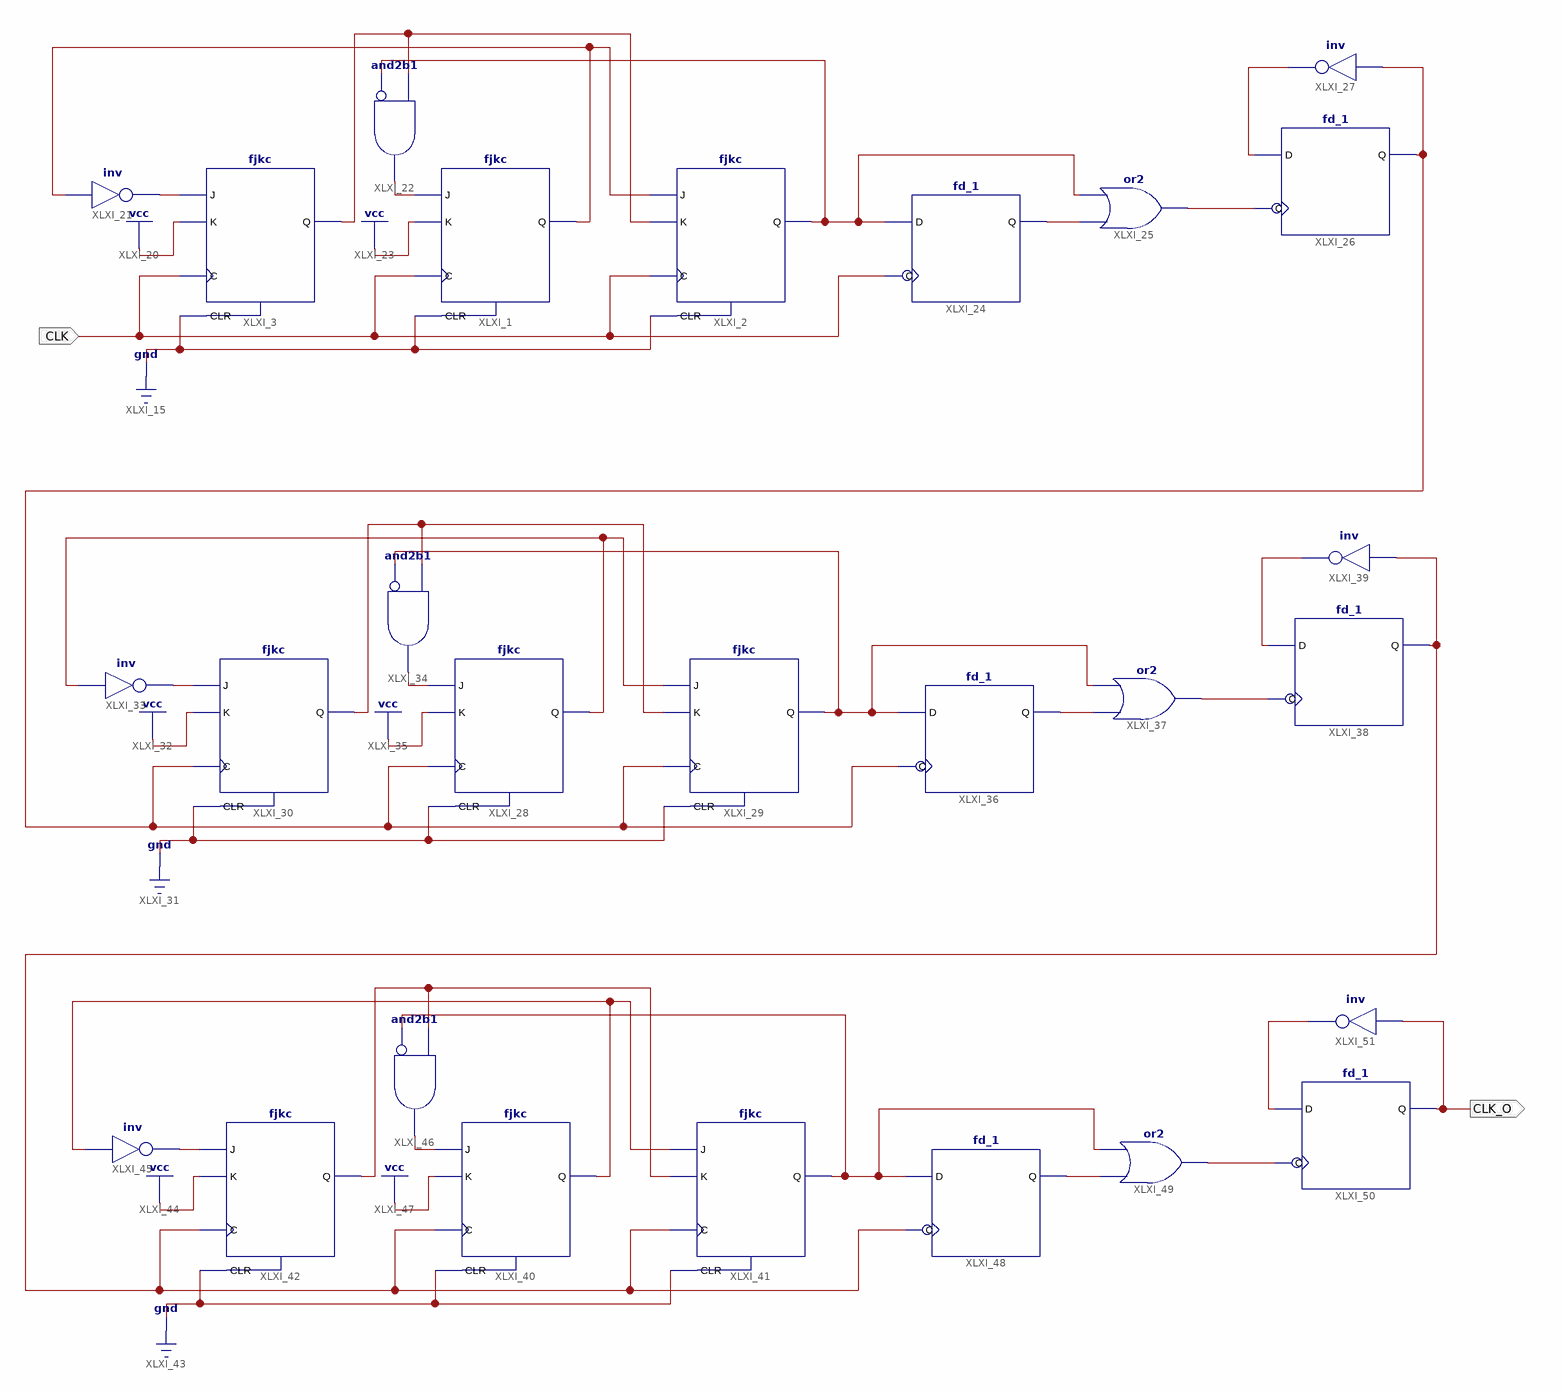
[diagram p0: schematic sheet 1]
// Xilinx ISE schematic ClockDiv1K.sch (spartan6) as structural Verilog: 27 symbols, 2 ports
module ClockDiv1K (
  input  CLK,
  output CLK_O
);

  wire CLKOWO, XLXN_29, XLXN_30, XLXN_33, XLXN_34, XLXN_35, XLXN_38, XLXN_39, XLXN_123, XLXN_130, XLXN_131,
       XLXN_133, XLXN_134, XLXN_135, XLXN_137, XLXN_138, XLXN_139, XLXN_140, XLXN_147, XLXN_148, XLXN_150,
       XLXN_151, XLXN_152, XLXN_154, XLXN_155, XLXN_156;

  fjkc XLXI_1 (.C(CLK), .CLR(1'b0), .J(XLXN_35), .K(1'b1), .Q(XLXN_30));
  fjkc XLXI_2 (.C(CLK), .CLR(1'b0), .J(XLXN_30), .K(XLXN_34), .Q(XLXN_33));
  fjkc XLXI_3 (.C(CLK), .CLR(1'b0), .J(XLXN_29), .K(1'b1), .Q(XLXN_34));
  not XLXI_21 (XLXN_29, XLXN_30);
  and XLXI_22 (XLXN_35, ~XLXN_33, XLXN_34);  // and2b1
  fd_1 XLXI_24 (.C(CLK), .D(XLXN_33), .Q(XLXN_38));
  or XLXI_25 (XLXN_123, XLXN_38, XLXN_33);
  fd_1 XLXI_26 (.C(XLXN_123), .D(XLXN_39), .Q(CLKOWO));
  not XLXI_27 (XLXN_39, CLKOWO);
  fjkc XLXI_28 (.C(CLKOWO), .CLR(1'b0), .J(XLXN_135), .K(1'b1), .Q(XLXN_131));
  fjkc XLXI_29 (.C(CLKOWO), .CLR(1'b0), .J(XLXN_131), .K(XLXN_134), .Q(XLXN_133));
  fjkc XLXI_30 (.C(CLKOWO), .CLR(1'b0), .J(XLXN_130), .K(1'b1), .Q(XLXN_134));
  not XLXI_33 (XLXN_130, XLXN_131);
  and XLXI_34 (XLXN_135, ~XLXN_133, XLXN_134);  // and2b1
  fd_1 XLXI_36 (.C(CLKOWO), .D(XLXN_133), .Q(XLXN_138));
  or XLXI_37 (XLXN_137, XLXN_138, XLXN_133);
  fd_1 XLXI_38 (.C(XLXN_137), .D(XLXN_139), .Q(XLXN_140));
  not XLXI_39 (XLXN_139, XLXN_140);
  fjkc XLXI_40 (.C(XLXN_140), .CLR(1'b0), .J(XLXN_152), .K(1'b1), .Q(XLXN_148));
  fjkc XLXI_41 (.C(XLXN_140), .CLR(1'b0), .J(XLXN_148), .K(XLXN_151), .Q(XLXN_150));
  fjkc XLXI_42 (.C(XLXN_140), .CLR(1'b0), .J(XLXN_147), .K(1'b1), .Q(XLXN_151));
  not XLXI_45 (XLXN_147, XLXN_148);
  and XLXI_46 (XLXN_152, ~XLXN_150, XLXN_151);  // and2b1
  fd_1 XLXI_48 (.C(XLXN_140), .D(XLXN_150), .Q(XLXN_155));
  or XLXI_49 (XLXN_154, XLXN_155, XLXN_150);
  fd_1 XLXI_50 (.C(XLXN_154), .D(XLXN_156), .Q(CLK_O));
  not XLXI_51 (XLXN_156, CLK_O);
endmodule
